# EAGLE design power-monitor (EAGLE 8.1.0)
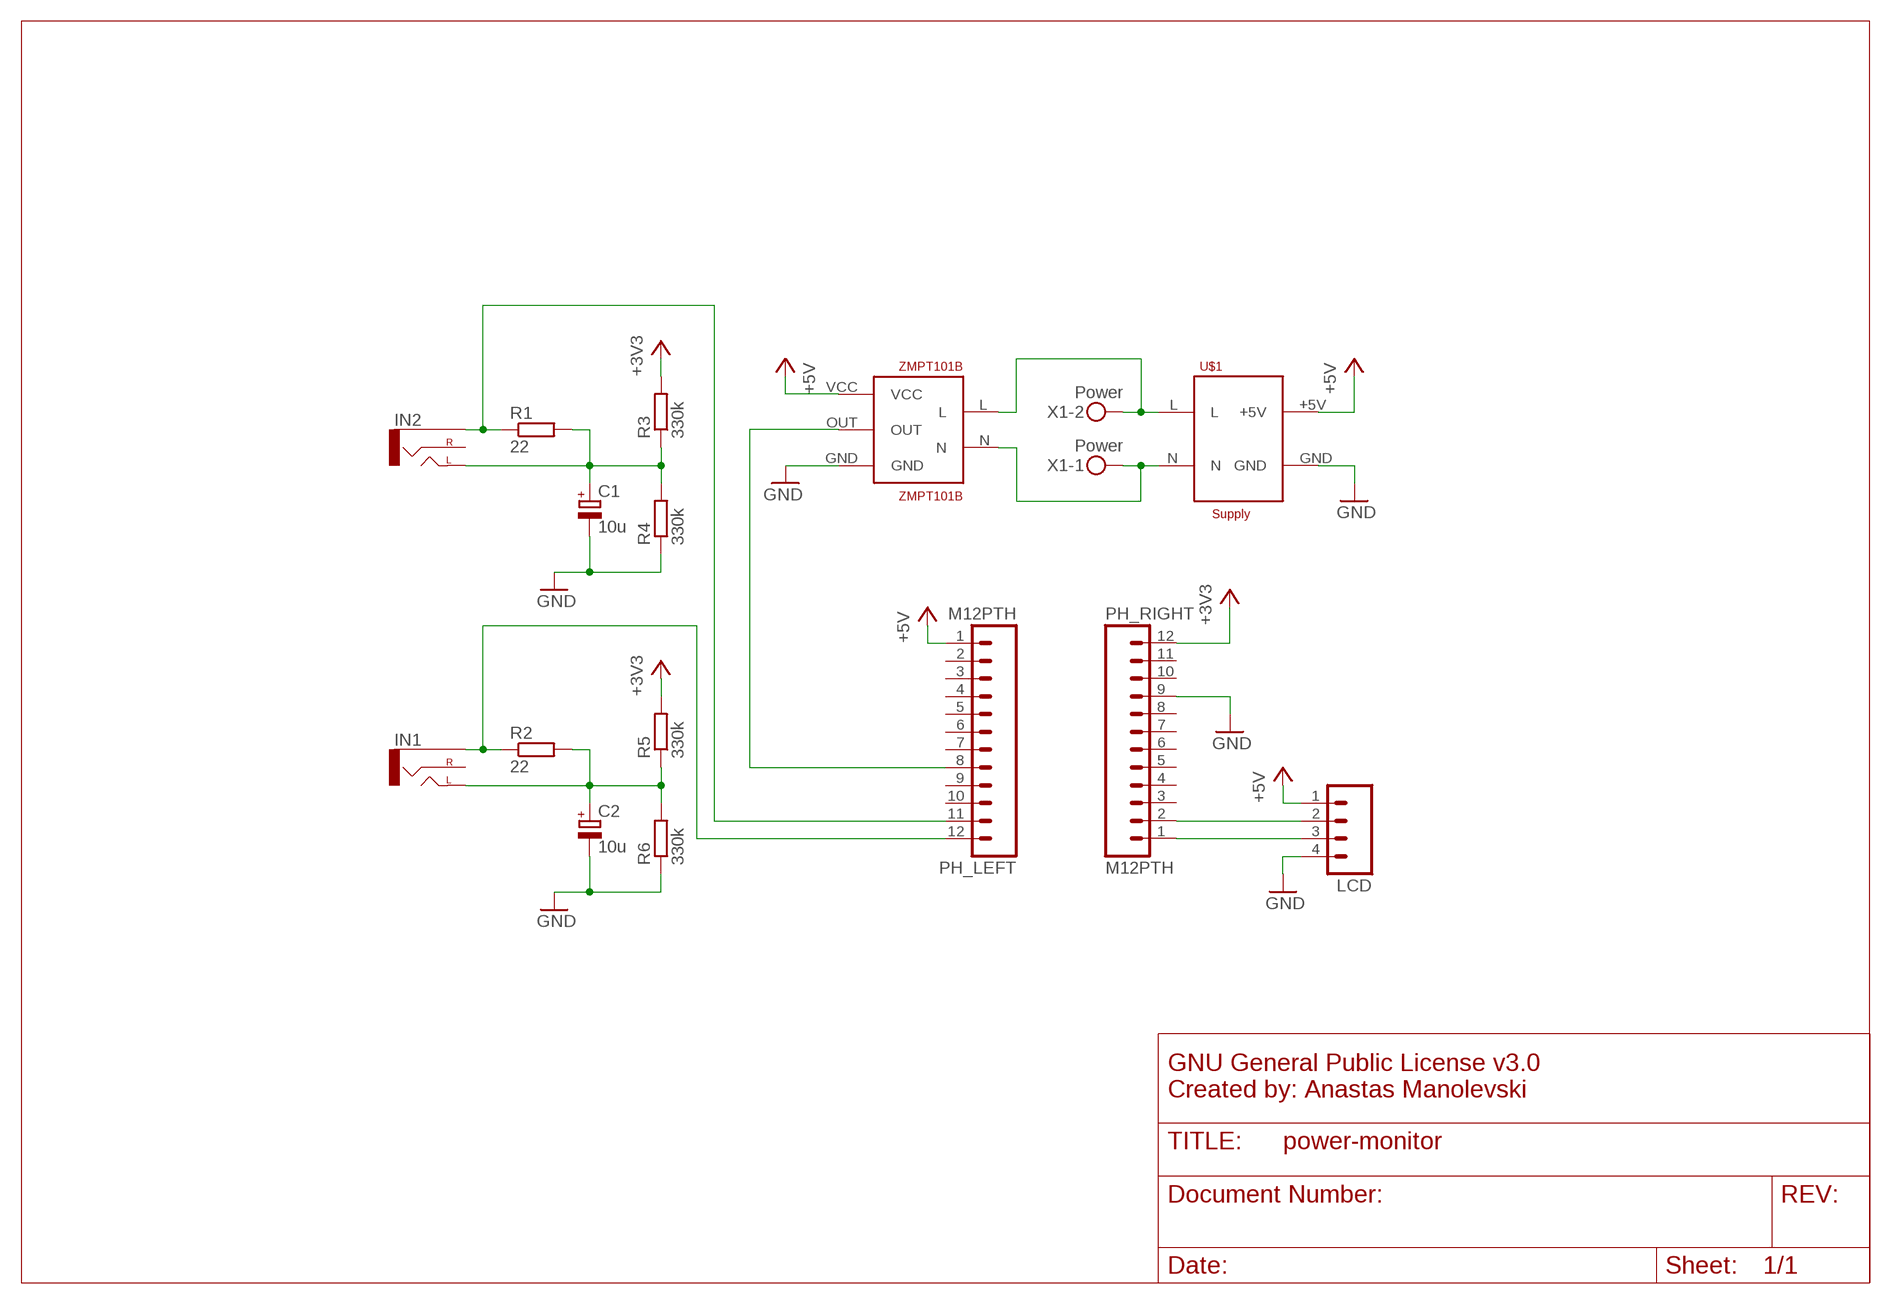
[diagram p0: schematic, sheet 1]

## Parts
C1  10u  CPOL-EUE2.5-5  [E2,5-5]
C2  10u  CPOL-EUE2.5-5  [E2,5-5]
IN1  AUDIO-JACKPTH  [AUDIO-JACK]
IN2  AUDIO-JACKPTH  [AUDIO-JACK]
LCD  M04PTH  [1X04]
PH_LEFT  M12PTH  [1X12-SMALL-PADS]
PH_RIGHT  M12PTH  [1X12-SMALL-PADS]
R1  22  R-EU_0204/7  [0204/7]
R2  22  R-EU_0204/7  [0204/7]
R3  330k  R-EU_0204/7  [0204/7]
R4  330k  R-EU_0204/7  [0204/7]
R5  330k  R-EU_0204/7  [0204/7]
R6  330k  R-EU_0204/7  [0204/7]
U$1  Supply  PWR-SUPP  [PWR-SUPP]
X1  Power  MKDSN1,5/2-5,08  [MKDSN1,5/2-5,08]
ZMPT101B  ZMPT101B  [ZMPT101B]

## Nets
+3V3: PH_RIGHT.12 R3.2 R5.2
+5V: LCD.1 PH_LEFT.1 U$1.+5V ZMPT101B.VCC
GND: C1.- C2.- LCD.4 PH_RIGHT.9 R4.1 R6.1 U$1.GND ZMPT101B.GND
N$1: IN1.SLEEVE PH_LEFT.12 R2.1
N$2: C1.+ IN2.TIP(LEFT) R1.2 R3.1 R4.2
N$3: IN2.SLEEVE PH_LEFT.11 R1.1
N$4: C2.+ IN1.TIP(LEFT) R2.2 R5.1 R6.2
N$5: LCD.3 PH_RIGHT.1
N$6: LCD.2 PH_RIGHT.2
N$7: PH_LEFT.8 ZMPT101B.OUT
N$8: U$1.L X1.2 ZMPT101B.L
N$9: U$1.N X1.1 ZMPT101B.N
Unconnected: IN1.RING(RIGHT) IN2.RING(RIGHT) PH_LEFT.2 PH_LEFT.3 PH_LEFT.4 PH_LEFT.5 PH_LEFT.6 PH_LEFT.7 PH_LEFT.9 PH_LEFT.10 PH_RIGHT.3 PH_RIGHT.4 PH_RIGHT.5 PH_RIGHT.6 PH_RIGHT.7 PH_RIGHT.8 PH_RIGHT.10 PH_RIGHT.11

## Notes on the sheet
- GNU General Public License v3.0
  Created by: Anastas Manolevski

## Library data of the parts
C1 C2 = rcl:CPOL-EU: POLARIZED CAPACITOR, European symbol
IN1 IN2 = SparkFun-Connectors:AUDIO-JACK: 3.5mm Audio Jack Simple 3.5mm common PCB mount audio jack. Variant PTH is our storefront SKU PRT-08032
LCD = SparkFun-Connectors:M04: Header 4 Standard 4-pin 0.1" header. Use with straight break away headers (SKU : PRT-00116), right angle break away headers (PRT-00553), swiss pins (PRT-00743), machine pins (PRT-00117), and female headers (PRT-00115). Molex polarized connector foot print use with SKU : PRT-08231 with associated crimp pins and housings. 1MM SMD Version SKU: PRT-10208; PROD_ID: CONN-09696
PH_LEFT PH_RIGHT = Spark:M12: Header 12 Standard 12-pin 0.1" header. Use with straight break away headers (SKU : PRT-00116), right angle break away headers (PRT-00553), swiss pins (PRT-00743), machine pins (PRT-00117), and female headers (PRT-00115).
R1-R6 = resistor:R-EU_: RESISTOR, European symbol
U$1 = boiler-control:PWR-SUPP
X1 = con-phoenix-508:MKDSN1,5/2-5,08: MKDSN 1,5/ 2-5,08 Printklemme Nennstrom: 13,5 A Nennspannung: 250 V Rastermaß: 5,08 mm Polzahl: 2 Anschlussart: Schraubanschluss Montage: Löten Anschlussrichtung Leiter/Platine: 0 ° Artikelnummer: 1729128 Source: http://eshop.phoenixcontact.com .. 1729128.pdf
ZMPT101B = apm:ZMPT101B

## Board
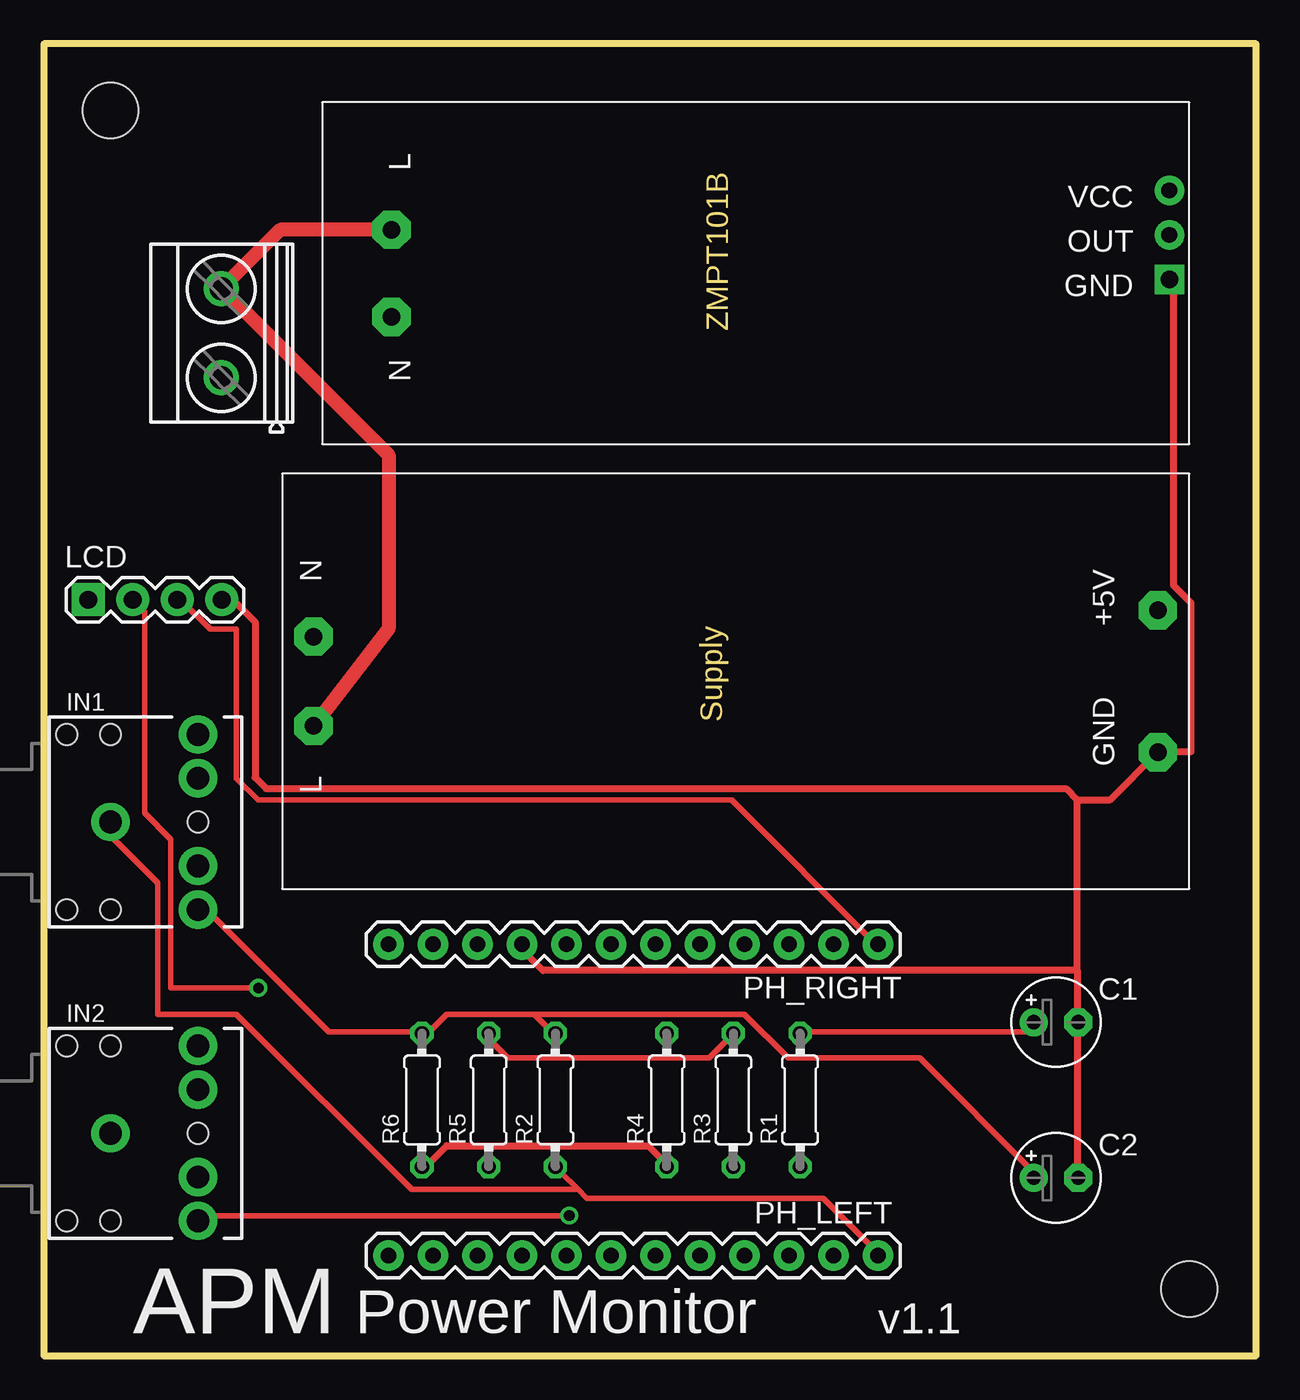
[diagram p1: board, top side]
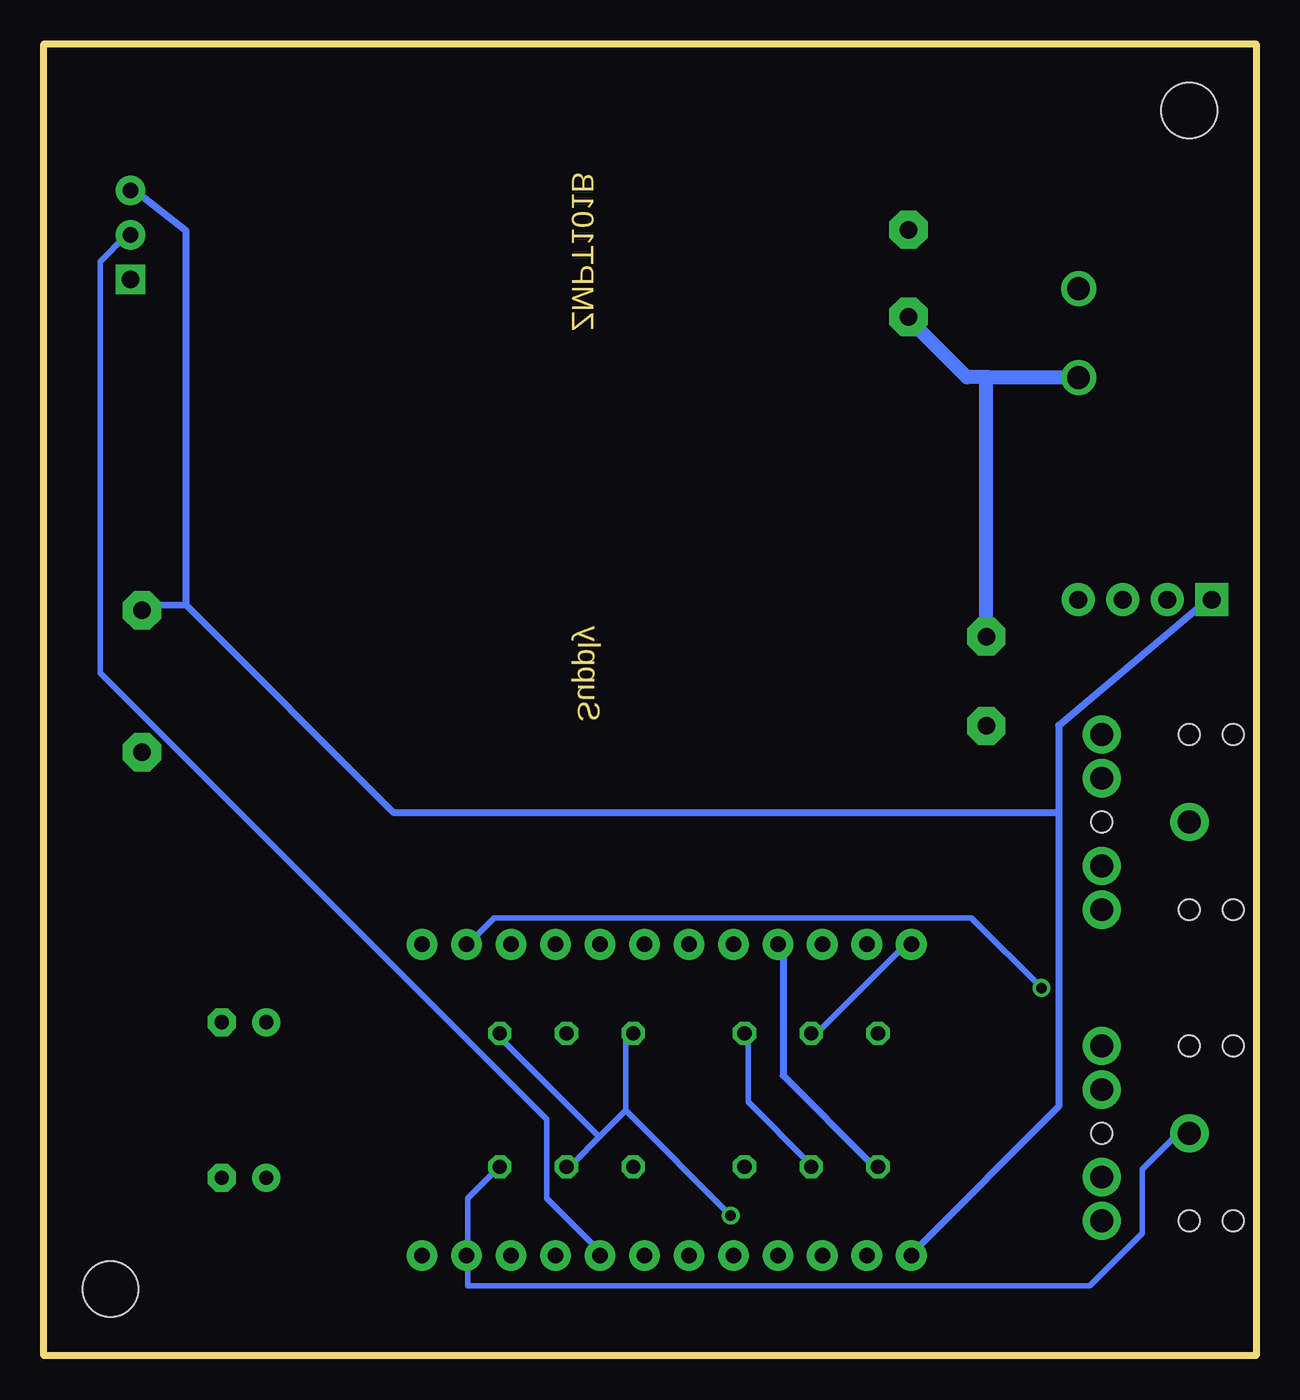
[diagram p2: board, bottom side, seen from below]

Size 69.22 x 74.93 mm. Coordinates in mm from the lower left corner, seen from the top.
Outline: 0,0 69.22,0 69.22,74.93 0,74.93 0,0
Copper layers (1*16): Top 0.035mm / dielectric 1.5mm / Bottom 0.035mm
Design rules "default *": minimum track width 12mil, minimum drill 24mil, track to track 10mil, track to pad 10mil, pad to pad 10mil, via to via 10mil, smd to smd 10mil, copper to edge 40mil, drill to drill 6mil, minimum pad ring 10mil, minimum via ring 8mil, stop-mask expansion 4mil, vias tented up to drill 0mil, thermal gap 10mil
Holes 3.2 mm at 3.81,71.12 65.41,3.81

### Footprints (pad centres in the part's own frame; a part is rotated, then mirrored left to right if it is on the bottom)
E2,5-5 = drill 0.813 pad 1.6: + -1.27,0 | drill 0.813 pad 1.6 octagon: - 1.27,0
AUDIO-JACK = drill 1.3 pad 2.184: RING 5,5; RSH 5,2.5; SLEEVE 0,0; TIP 5,-5; TSH 5,-2.5 | hole 1.2: 0,5; -2.5,5; -2.5,-5; 0,-5; 5,0
1X04 = drill 1.016 pad 1.88 square: 1 0,0 | drill 1.016 pad 1.88: 2 2.54,0; 3 5.08,0; 4 7.62,0
1X12-SMALL-PADS = drill 0.889 pad 1.753: 1 0,0; 2 2.54,0; 3 5.08,0; 4 7.62,0; 5 10.16,0; 6 12.7,0; 7 15.24,0; 8 17.78,0; 9 20.32,0; 10 22.86,0; 11 25.4,0; 12 27.94,0
0204/7 = drill 0.813 octagon: 1 -3.81,0; 2 3.81,0
PWR-SUPP = drill 1 pad 2.184 octagon: +5V 15.9,1.8; GND 7.8,1.8; L 9.3,50; N 14.4,50
MKDSN1,5/2-5,08 = drill 1.3 pad 2: 1 -2.561,0.025; 2 2.519,0.025
ZMPT101B = drill 1 pad 1.676 square: GND 9.398,1.143 | drill 1 pad 2.184 octagon: L 12.241,45.555; N 7.268,45.555 | drill 0.9 pad 1.676: OUT 11.938,1.143; VCC 14.478,1.143

### Placement (x,y rotation side)
C1  57.78,19.05 0 top
C2  57.78,10.16 0 top
IN1  3.81,30.48 0 top
IN2  3.81,12.7 0 top
LCD  2.54,43.18 0 top
PH_LEFT  19.68,5.71 0 top
PH_RIGHT  47.62,23.5 180 top
R1  43.18,14.61 90 top
R2  29.21,14.61 90 top
R3  39.37,14.61 90 top
R4  35.56,14.61 90 top
R5  25.4,14.61 90 top
R6  21.59,14.61 90 top
U$1  65.41,26.67 90 top
X1  10.16,58.42 90 top
ZMPT101B  65.41,52.07 90 top

### Tracks (layer width: path | path; a pad name or v marks a point on that pad's centre or on a via)
+3V3
  Top 0.305: R3.2 39,18 38,17 26.5,17 25.5,18 R5.2
  Bottom 0.305: R5.2 25,18.5 20,23.5 PH_RIGHT.12
+5V
  Bottom 0.406: 61.09,42.87 61.09,64.23 64,66.5 ZMPT101B.VCC | 11.27,31 11.27,36 3,43 LCD.1 | 11.27,31 11.27,14.23 19.5,6 PH_LEFT.1 | 61.09,42.87 49.23,31 11.27,31 | U$1.+5V 63.6,42.9 61.09,42.87
GND
  Top 0.305: 35.5,11 R4.1 | 59,19 C1.-
  Top 0.406: 35.5,11 34.5,12 23,12 22,11 R6.1 | 59,19 59,10.5 C2.- | ZMPT101B.GND 64.5,61 64.5,44 65.5,43 65.5,34.5 64,34.5 U$1.GND 60.88,31.75 59,31.75 | 59,22 59,31.75 | 59,22 59,19.5 C1.- | 59,22 28.5,22 27.5,23 PH_RIGHT.9 | LCD.4 10.79,43.18 12.06,41.91 12.06,33.02 12.7,32.38 58.37,32.38 59,31.75
  Bottom 0.305: 22,11 R6.1
  Bottom 0.406: 22,11 27,16 27,23 PH_RIGHT.9
N$1
  Top 0.305: 30.5,9.5 31,9 44.5,9 47.5,6 PH_LEFT.12 | 30.5,9.5 29.5,10.5 R2.1 | 30.5,9.5 21,9.5 11,19.5 6.5,19.5 6.5,27 3.5,30 IN1.SLEEVE
N$2  (via drill 0.61)
  Top 0.305: C1.+ 56.5,19 56,18.5 43.5,18.5 R1.2 | v30,8 9.77,8 IN2.TIP
  Bottom 0.305: 36,14 37.5,12.5 | 37.5,12.5 39,11 R3.1 | 36,14 36,18 R4.2 | 37.5,12.5 43,18 R1.2 | 36,14 v30,8
N$3
  Bottom 0.305: R1.1 43.5,10.5 45,9 45,6 PH_LEFT.11 45,5.5 45,4 9.5,4 6.5,7 6.5,10.64 4.45,12.7 IN2.SLEEVE
N$4
  Top 0.305: 28,19.5 23,19.5 22,18.5 R6.2 21.5,18.5 16.27,18.5 9.77,25 IN1.TIP | 28,19.5 29,18.5 R2.2 | 28,19.5 40,19.5 42.5,17 50,17 56.5,10.5 C2.+
  Bottom 0.305: R5.1 25.5,11 29,14.5 29,18 R2.2
N$5
  Top 0.305: PH_RIGHT.1 47.5,23.5 39.27,31.73 12.23,31.73 11,32.96 11,41.5 9.5,41.5 8,43 LCD.3
N$6  (via drill 0.61)
  Top 0.305: 45,23.5 PH_RIGHT.2 | v12.25,21 7.25,21 7.25,29.5 5.75,31 5.75,42.5 5.25,43 LCD.2
  Bottom 0.305: v12.25,21 16.25,25 43.5,25 45,23.5 PH_RIGHT.2
N$7
  Bottom 0.305: ZMPT101B.OUT 64.5,64 66,62.5 66,39 40.5,13.5 40.5,9 37.5,6 PH_LEFT.8
N$8
  Top 0.813: ZMPT101B.L 13.51,64.31 X1.2 10.82,60.3 19.68,51.44 19.68,41.52 U$1.L
N$9
  Bottom 0.813: ZMPT101B.N 19.85,59.22 16.51,55.88 15.24,55.88 | 15.24,55.88 10.16,55.88 X1.1 | U$1.N 15.4,55.72 15.24,55.88

### Text on the board
Dimension: Supply
tNames: APM | Power Monitor | v1.1